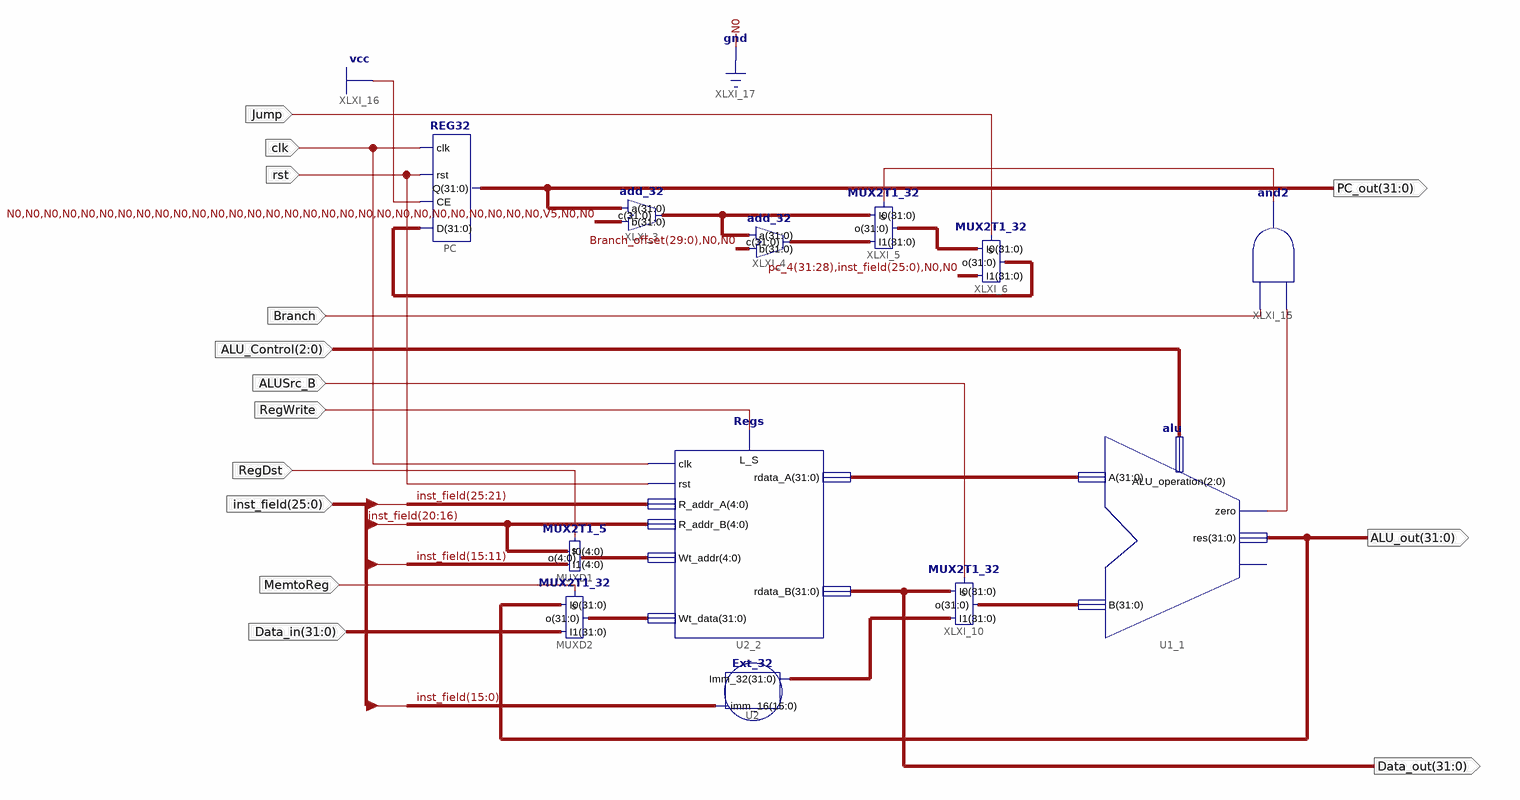
[diagram p0: schematic sheet 1]
// Xilinx ISE schematic Data_path.sch (kintex7) as structural Verilog: 12 symbols, 14 ports
module Data_path (
  input  ALUSrc_B,
  input  RegWrite,
  input  [25:0] inst_field,
  input  RegDst,
  input  MemtoReg,
  input  [31:0] Data_in,
  input  [2:0] ALU_Control,
  input  clk,
  input  rst,
  input  Branch,
  input  Jump,
  output [31:0] Data_out,
  output [31:0] ALU_out,
  output [31:0] PC_out
);

  wire V5, XLXN_43, XLXN_64;
  wire [4:0] XLXN_17;
  wire [31:0] Branch_offset, XLXN_28, XLXN_31, XLXN_32, XLXN_50, XLXN_52, XLXN_59, XLXN_60;
  wire [31:28] pc_4;

  add_32 XLXI_3 (.c(XLXN_50), .a(PC_out), .b({{29{1'b0}}, V5, 2'b00}));
  add_32 XLXI_4 (.c(XLXN_52), .a(XLXN_50), .b({Branch_offset[29:0], 2'b00}));
  MUX2T1_32 XLXI_5 (.s(XLXN_64), .I0(XLXN_50), .I1(XLXN_52), .o(XLXN_59));
  MUX2T1_32 XLXI_6 (.s(Jump), .I0(XLXN_59), .I1({pc_4, inst_field, 2'b00}), .o(XLXN_60));
  MUX2T1_5 MUXD1 (.I1(inst_field[15:11]), .I0(inst_field[20:16]), .o(XLXN_17), .s(RegDst));
  MUX2T1_32 MUXD2 (.s(MemtoReg), .I0(ALU_out), .I1(Data_in), .o(XLXN_28));
  Ext_32 U2 (.imm_16(inst_field[15:0]), .Imm_32(Branch_offset));
  MUX2T1_32 XLXI_10 (.s(ALUSrc_B), .I0(Data_out), .I1(Branch_offset), .o(XLXN_32));
  alu U1_1 (.zero(XLXN_43), .res(ALU_out), .A(XLXN_31), .B(XLXN_32), .ALU_operation(ALU_Control));  // open: overflow
  Regs U2_2 (
    .clk(clk), .L_S(RegWrite), .rdata_A(XLXN_31), .rst(rst), .Wt_data(XLXN_28), .rdata_B(Data_out),
    .R_addr_A(inst_field[25:21]), .R_addr_B(inst_field[20:16]), .Wt_addr(XLXN_17));
  REG32 PC (.D(XLXN_60), .CE(1'b1), .rst(rst), .clk(clk), .Q(PC_out));
  and XLXI_15 (XLXN_64, XLXN_43, Branch);
endmodule
